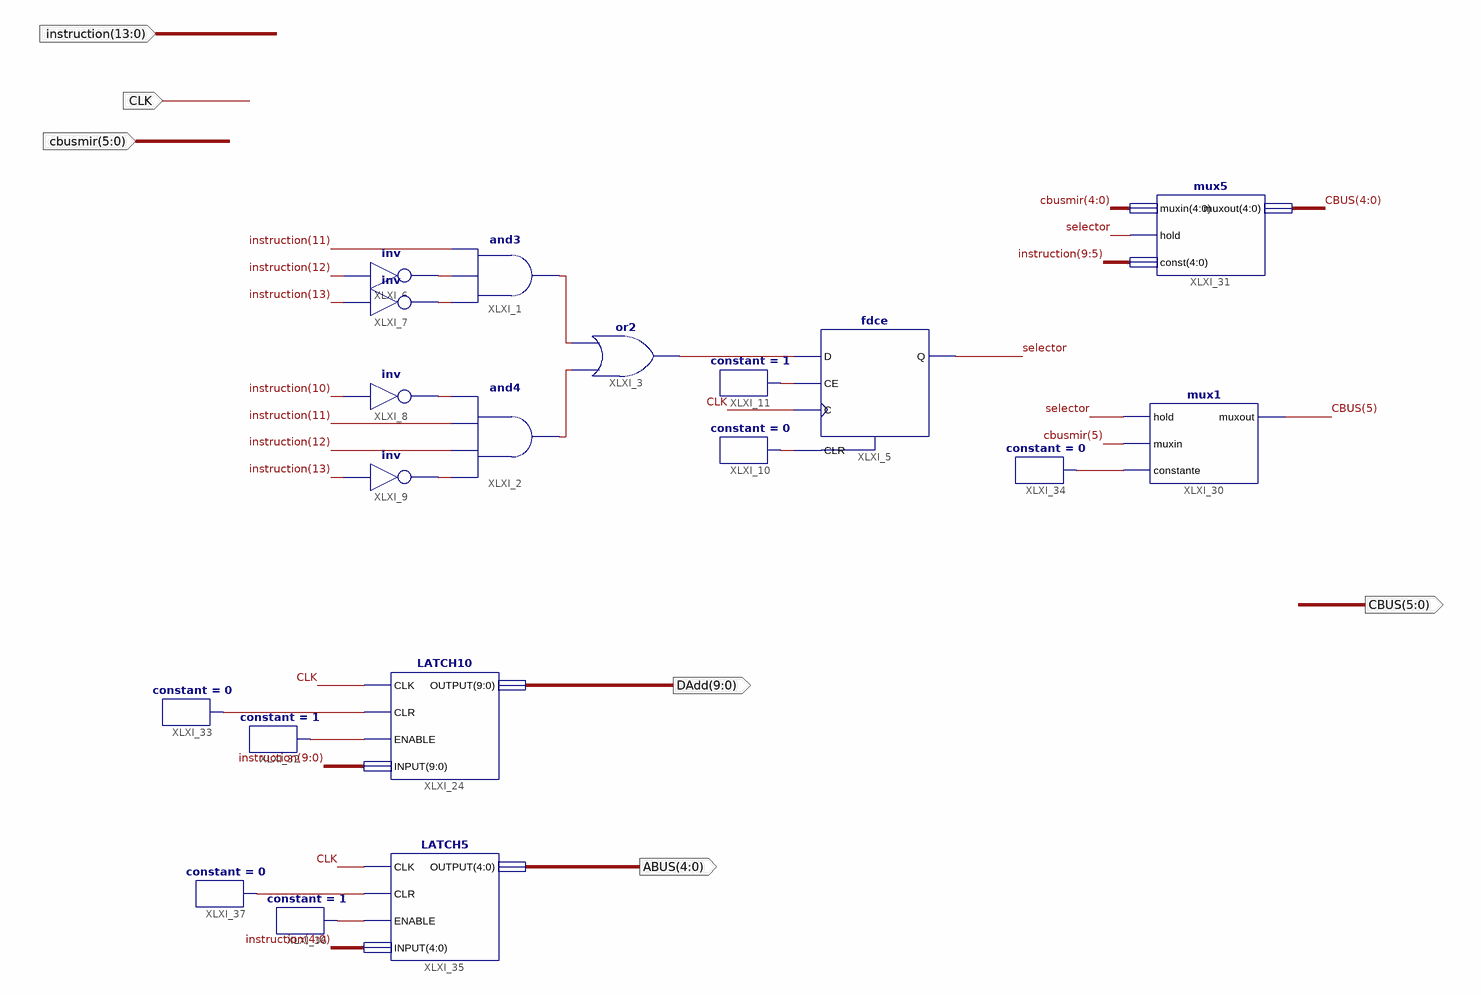
[diagram p0: schematic sheet 1]
// Xilinx ISE schematic Decode.sch (artix7) as structural Verilog: 19 symbols, 6 ports
module Decode (
  input  CLK,
  input  [13:0] instruction,
  input  [5:0] cbusmir,
  output [9:0] DAdd,
  output [5:0] CBUS,
  output [4:0] ABUS
);

  wire selector, XLXN_3, XLXN_4, XLXN_5, XLXN_6, XLXN_7, XLXN_8, XLXN_9, XLXN_10, XLXN_11, XLXN_120,
       XLXN_121, XLXN_135, XLXN_136, XLXN_147;

  and XLXI_1 (XLXN_4, XLXN_7, XLXN_6, instruction[11]);
  and XLXI_2 (XLXN_5, XLXN_9, instruction[12], instruction[11], XLXN_8);
  fdce XLXI_5 (.C(CLK), .CE(XLXN_11), .CLR(XLXN_10), .D(XLXN_3), .Q(selector));
  not XLXI_6 (XLXN_6, instruction[12]);
  not XLXI_7 (XLXN_7, instruction[13]);
  not XLXI_8 (XLXN_8, instruction[10]);
  not XLXI_9 (XLXN_9, instruction[13]);
  constant #(.CValue("0")) XLXI_10 (.O(XLXN_10));
  or XLXI_3 (XLXN_3, XLXN_5, XLXN_4);
  constant #(.CValue("1")) XLXI_11 (.O(XLXN_11));
  LATCH10 XLXI_24 (.CLK(CLK), .CLR(XLXN_120), .ENABLE(XLXN_121), .INPUT(instruction[9:0]), .OUTPUT(DAdd));
  mux1 XLXI_30 (.hold(selector), .muxin(cbusmir[5]), .constante(XLXN_147), .muxout(CBUS[5]));
  mux5 XLXI_31 (.muxin(cbusmir[4:0]), .hold(selector), .\const (instruction[9:5]), .muxout(CBUS[4:0]));
  constant #(.CValue("1")) XLXI_32 (.O(XLXN_121));
  constant #(.CValue("0")) XLXI_33 (.O(XLXN_120));
  constant #(.CValue("0")) XLXI_34 (.O(XLXN_147));
  LATCH5 XLXI_35 (.CLK(CLK), .CLR(XLXN_135), .ENABLE(XLXN_136), .INPUT(instruction[4:0]), .OUTPUT(ABUS));
  constant #(.CValue("1")) XLXI_36 (.O(XLXN_136));
  constant #(.CValue("0")) XLXI_37 (.O(XLXN_135));
endmodule
